# Altium schematic sheet MCU.SchDoc
size A3; SheetNumber: 1; SheetTotal: 2; SPICEModelCacheEDVCCXKY: <root> / <DocumentId>EDVCCXKY</DocumentId> / </root>
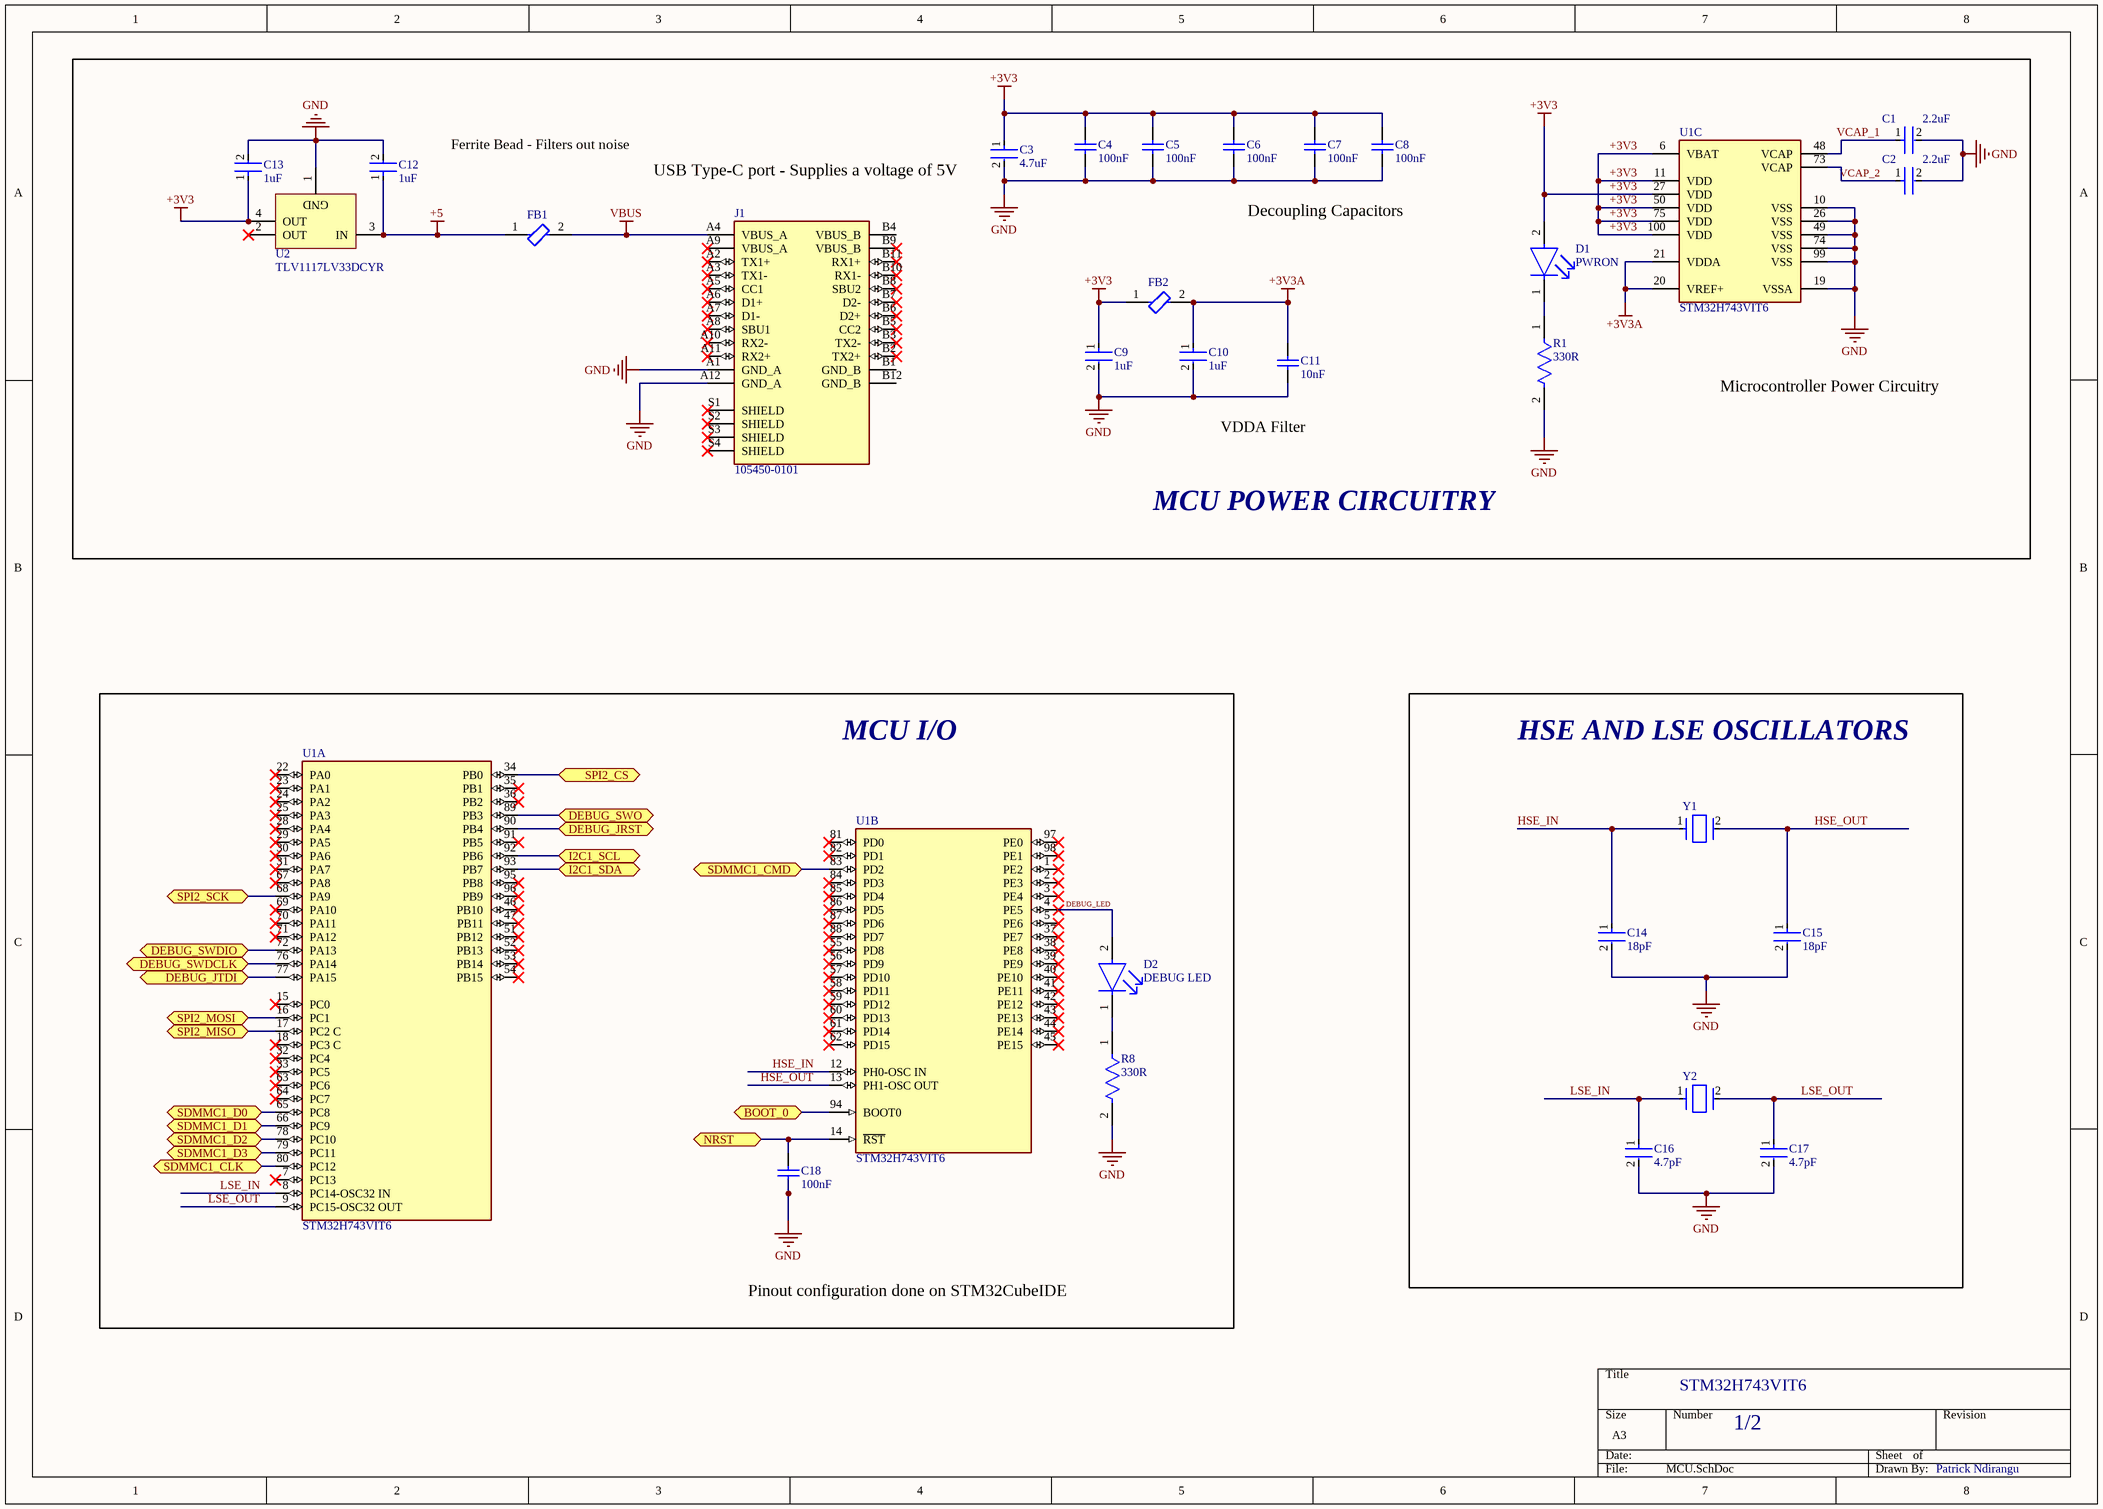
[diagram p0: MCU.SchDoc]

## Parts
C1  2.2uF  [FP-0805-L_2_01_0_2-W_1_25-IPC_C]
C2  2.2uF  [FP-0805-L_2_01_0_2-W_1_25-IPC_C]
C3  4.7uF  [FP-CL21-IPC_A]
C4  100nF  [CAPC1050X55X23ML05T13]
C5  100nF  [CAPC1050X55X23ML05T13]
C6  100nF  [CAPC1050X55X23ML05T13]
C7  100nF  [CAPC1050X55X23ML05T13]
C8  100nF  [CAPC1050X55X23ML05T13]
C9  1uF  [FP-CL10-IPC_C]
C10  1uF  [FP-CL10-IPC_C]
C11  10nF  [CAPC1608X90X35ML10T15]
C12  1uF  [FP-CL10-IPC_C]
C13  1uF  [FP-CL10-IPC_C]
C14  18pF  [FP-CL10-IPC_A]
C15  18pF  [FP-CL10-IPC_A]
C16  4.7pF  [FP-CL10-IPC_C]
C17  4.7pF  [FP-CL10-IPC_C]
C18  100nF  [CAPC1050X55X23ML05T13]
D1  PWRON  [FP-6_541-5092_01-4-MFG]
D2  DEBUG LED  [FP-6_541-5094_01-4-MFG]
FB1  MMZ1005D121CTD25  [FP-MMZ1005-IPC_C]  (value not drawn)
FB2  MMZ1005D121CTD25  [FP-MMZ1005-IPC_C]  (value not drawn)
J1  105450-0101  [MOLEX_105450-0101]
R1  330R  [FP-KTR03-MFG]
R8  330R  [FP-KTR03-MFG]
U1  STM32H743VIT6  [FP-LQFP100-1L-MFG]  (parts A,B,C of 3)
U2  TLV1117LV33DCYR  [DCY0004A_N]
Y1  ABM2-25.000MHZ-D4Y-T  [FP-ABM2-MFG]  (value not drawn)
Y2  ABS06-107-32.768KHZ-T  [FP-ABS06-MFG]  (value not drawn)

## Blocks framed on the sheet
MCU POWER CIRCUITRY: C1-C13 D1 FB1 FB2 J1 R1 U1 U2
MCU I/O: C18 D2 R8 U1
HSE AND LSE OSCILLATORS: C14-C17 Y1 Y2

## Ports
BOOT_0 (bidir, see OTHER PARTS[7C]), DEBUG_JRST (bidir, see OTHER PARTS[6C]), DEBUG_JTDI (bidir, see OTHER PARTS[6C]), DEBUG_SWDCLK (bidir, see OTHER PARTS[6C]), DEBUG_SWDIO (bidir, see OTHER PARTS[6C]), DEBUG_SWO (bidir, see OTHER PARTS[6C]), I2C1_SCL (bidir, see OTHER PARTS[2C]), I2C1_SDA (bidir, see OTHER PARTS[2C]), NRST (bidir, see OTHER PARTS[7D]), SDMMC1_CLK (bidir, see OTHER PARTS[3B]), SDMMC1_CMD (bidir, see OTHER PARTS[3B]), SDMMC1_D0 (bidir, see OTHER PARTS[3B]), SDMMC1_D1 (bidir, see OTHER PARTS[3B]), SDMMC1_D2 (bidir, see OTHER PARTS[3B]), SDMMC1_D3 (bidir, see OTHER PARTS[3B]), SPI2_CS (bidir, see OTHER PARTS[2C]), SPI2_MISO (bidir, see OTHER PARTS[2C]), SPI2_MOSI (bidir, see OTHER PARTS[2C]), SPI2_SCK (bidir, see OTHER PARTS[2C])

## Nets
+3V3: C3.1 C4.2 C5.2 C6.2 C7.2 C8.2 C9.1 C13.1 D1.2(A) FB2.1 U1.6(VBAT) U1.11(VDD) U1.27(VDD) U1.50(VDD) U1.75(VDD) U1.100(VDD) U2.4(OUT)
+3V3A: C10.1 C11.2 FB2.2 U1.20(VREF+) U1.21(VDDA)
+5: C12.1 FB1.1 U2.3(IN)
GND: C1.2 C2.2 C3.2 C4.1 C5.1 C6.1 C7.1 C8.1 C9.2 C10.2 C11.1 C12.2 C13.2 C14.2 C15.2 C16.2 C17.2 C18.1 J1.A1(GND_A) J1.A12(GND_A) R1.2 R8.2 U1.10(VSS) U1.19(VSSA) U1.26(VSS) U1.49(VSS) U1.74(VSS) U1.99(VSS) U2.1(GND)
VBUS: FB1.2 J1.A4(VBUS_A)
BOOT_0: U1.94(BOOT0) ; port BOOT_0
DEBUG_JRST: U1.90(PB4) ; port DEBUG_JRST
DEBUG_JTDI: U1.77(PA15) ; port DEBUG_JTDI
DEBUG_LED: D2.2(A) U1.4(PE5)
DEBUG_SWDCLK: U1.76(PA14) ; port DEBUG_SWDCLK
DEBUG_SWDIO: U1.72(PA13) ; port DEBUG_SWDIO
DEBUG_SWO: U1.89(PB3) ; port DEBUG_SWO
HSE_IN: C14.1 U1.12(PH0-OSC_IN) Y1.1
HSE_OUT: C15.1 U1.13(PH1-OSC_OUT) Y1.2
I2C1_SCL: U1.92(PB6) ; port I2C1_SCL
I2C1_SDA: U1.93(PB7) ; port I2C1_SDA
LSE_IN: C16.1 U1.8(PC14-OSC32_IN) Y2.1
LSE_OUT: C17.1 U1.9(PC15-OSC32_OUT) Y2.2
NRST: C18.2 U1.14(~{RST}) ; port NRST
SDMMC1_CLK: U1.80(PC12) ; port SDMMC1_CLK
SDMMC1_CMD: U1.83(PD2) ; port SDMMC1_CMD
SDMMC1_D0: U1.65(PC8) ; port SDMMC1_D0
SDMMC1_D1: U1.66(PC9) ; port SDMMC1_D1
SDMMC1_D2: U1.78(PC10) ; port SDMMC1_D2
SDMMC1_D3: U1.79(PC11) ; port SDMMC1_D3
SPI2_CS: U1.34(PB0) ; port SPI2_CS
SPI2_MISO: U1.17(PC2_C) ; port SPI2_MISO
SPI2_MOSI: U1.16(PC1) ; port SPI2_MOSI
SPI2_SCK: U1.68(PA9) ; port SPI2_SCK
VCAP_1: C1.1 U1.48(VCAP)
VCAP_2: C2.1 U1.73(VCAP)
NetD1_1: D1.1(C) R1.1
NetD2_1: D2.1(C) R8.1

Not connected (* = marked no-connect by the designer): J1 A2(TX1+)* A3(TX1-)* A5(CC1)* A6(D1+)* A7(D1-)* A8(SBU1)* A9(VBUS_A)* A10(RX2-)* A11(RX2+)* B1(GND_B) B2(TX2+)* B3(TX2-)* B4(VBUS_B) B5(CC2)* B6(D2+)* B7(D2-)* B8(SBU2)* B9(VBUS_B)* B10(RX1-)* B11(RX1+)* B12(GND_B) S1(SHIELD)* S2(SHIELD)* S3(SHIELD)* S4(SHIELD)*; U1 1(PE2)* 2(PE3)* 3(PE4)* 5(PE6)* 7(PC13)* 15(PC0)* 18(PC3_C)* 22(PA0)* 23(PA1)* 24(PA2)* 25(PA3)* 28(PA4)* 29(PA5)* 30(PA6)* 31(PA7)* 32(PC4)* 33(PC5)* 35(PB1)* 36(PB2)* 37(PE7)* 38(PE8)* 39(PE9)* 40(PE10)* 41(PE11)* 42(PE12)* 43(PE13)* 44(PE14)* 45(PE15)* 46(PB10)* 47(PB11)* 51(PB12)* 52(PB13)* 53(PB14)* 54(PB15)* 55(PD8)* 56(PD9)* 57(PD10)* 58(PD11)* 59(PD12)* 60(PD13)* 61(PD14)* 62(PD15)* 63(PC6)* 64(PC7)* 67(PA8)* 69(PA10)* 70(PA11)* 71(PA12)* 81(PD0)* 82(PD1)* 84(PD3)* 85(PD4)* 86(PD5)* 87(PD6)* 88(PD7)* 91(PB5)* 95(PB8)* 96(PB9)* 97(PE0)* 98(PE1)*; U2 2(OUT)*

## Notes on the sheet
- Ferrite Bead - Filters out noise
- (near C3) USB Type-C port - Supplies a voltage of 5V
- Decoupling Capacitors
- VDDA Filter
- Microcontroller Power Circuitry
- Pinout configuration done on STM32CubeIDE
- STM32H743VIT6
- 1/2
- Patrick Ndirangu

## Library data of the parts
C1 C2 = CMP-2007-04247-2: General Purpose Ceramic Capacitor, 0805, 2.2uF, 10%, X5R, 15%, 25V; Voltage Rating (DC): 25V; RoHS Compliant: Yes; Max Operating Temperature: 85°C; Case/Package: 0805; Capacitance: 2.2uF; Packaging: Tape and Reel; Termination: SMD/SMT; Tolerance: 10%; Contact Plating: Tin; Width: 1.25mm; Radiation Hardening: No; Thickness: 0.037inch; Construction: Flat; Lead Free: Lead Free; Case Code (Metric): 2012; Series: -; Height: 1.4mm; Length: 2.01mm; Package Quantity: 1; Min Operating Temperature: -55°C; Dielectric: X5R; Voltage Rating: 25V; Number of Pins: 2; Case Code (Imperial): 0805; Mount: Surface Mount; Depth: 1.25mm
C3 = CMP-13271-002624-1: CL21 Series 0805 4.7uF 25V ±10% Tolerance X5R Multilayer Ceramic Chip Capacitor; Case Code (Imperial): 0805; Thickness: 0.055inch; Mount: Surface Mount; Case Code (Metric): 2012; Capacitance: 4.7uF; Depth: 1.25mm; Lead Free: Lead Free; Case/Package: 0805; Voltage Rating: 25V; Package Quantity: 1; Width: 0.049inch; Radiation Hardening: No; Voltage Rating (DC): 25V; Length: 2mm; Dielectric: X5R; Height: 1.25mm; Packaging: Tape and Reel; Tolerance: 10%; Min Operating Temperature: -55°C; Max Operating Temperature: 85°C
C4-C8 C18 = CMP-2000-05439-1: Chip Capacitor, 100 nF, +/- 10%, 16 V, -55 to 125 degC, 0402 (1005 Metric), RoHS, Tape and Reel; Manufacturer: Samsung Electro-Mechanics; Capacitance: 100000pF; Dielectric: X7R; Rated Voltage: 16V; Case Size/Dimension: 0402; Tolerance (%): ±10%; Manufacturer URL: http://www.samsungsem.com/global/index.jsp; Datasheet URL: https://datasheet.ciiva.com/29198/458718-da-01-en-vs-kondensator-0402-29198423.pdf; Datasheet Version: Nov-10
C9 C10 C12 C13 = CMP-13271-004127-1: Cap Ceramic 1uF 25V X5R ±10% Pad SMD 0603 +85°C T/R; Height: 0.8mm; Capacitance: 1uF; Depth: 0.8mm; Package Quantity: 1; Mount: Surface Mount; Contact Plating: Tin; Voltage Rating: 25V; Dielectric: X5R; Packaging: Tape and Reel; Material: Ceramic; Case Code (Metric): 1608; Length: 1.6mm; Voltage: 25V; Min Operating Temperature: -55°C; Width: 0.031inch; Tolerance: 10%; Case/Package: 0603; Radiation Hardening: No; Case Code (Imperial): 0603; Thickness: 0.035inch; Lead Free: Lead Free; Max Operating Temperature: 85°C; Voltage Rating (DC): 25V
C11 = CMP-2100-03642-1: Chip Capacitor, 10 nF, +/- 10%, 50 V, -55 to 125 degC, 0603 (1608 Metric), RoHS, Tape and Reel; Manufacturer: Murata; Insulation Resistance: 10GR; Dielectric: X7R; Voltage Rating: 50V; Material: Ceramic; Package Quantity: 1; Lead Free: LeadFree; Case/Package: 0603; Termination: SMD/SMT; REACH SVHC: Unknown; Manufacturer URL: http://www.murata.com/; Datasheet URL: http://search.murata.co.jp/Ceramy/image/img/A01X/G101/ENG/GRM188R71H103KA01-01.pdf; Mount: SurfaceMount; Datasheet Version: 42401.0; Number of Pins: 2; Length: 1.6mm; Voltage: 50V; Depth: 0.8mm; Tolerance: 10%; Min Operating Temperature: -55degC; Voltage Rating (DC): 50V; Max Operating Temperature: 125degC; Package Description: 2-Pin Surface Mount Device, Body 1.6 x 0.8 mm; RoHSCompliant: True; Case Code (Imperial): 0603; Width: 0.031inch; Case Code (Metric): 1608; Height: 0.8mm; Package Reference: 0603; Packaging: TapeandReel; Thickness: 0.035inch; Capacitance: 10nF; Dielectric Material: Ceramic
C14 C15 = CMP-2000-06099-2: Cap Ceramic 18pF 50V C0G ±5% Pad SMD 0603 +125°C T/R; Temperature Coefficient: 300ppm/°C; Tolerance: 5%; Case/Package: 0603; Case Code (Metric): 1608; Depth: 0.8mm; Case Code (Imperial): 0603; Length: 1.6mm; Voltage Rating: 50V; Mount: Surface Mount; Thickness: 0.035inch; Radiation Hardening: No; Contact Plating: Tin; Voltage: 50V; Height: 0.8mm; Width: 0.031inch; Packaging: Tape and Reel; Max Operating Temperature: 125°C; Material: Ceramic; Min Operating Temperature: -55°C; Capacitance: 18pF; Dielectric: C0G
C16 C17 = CMP-13271-002893-1: Cap Ceramic 4.7pF 50V C0G ±0.25pF Pad SMD 0603 +125°C T/R; Temperature Coefficient: 300ppm/°C; Lead Free: Lead Free; Voltage Rating (DC): 50V; Width: 0.031inch; Package Quantity: 1; Voltage: 50V; Dielectric: C0G; Mount: Surface Mount; Case Code (Imperial): 0603; Max Operating Temperature: 125°C; Case Code (Metric): 1608; Length: 1.6mm; Material: Ceramic; Radiation Hardening: No; Min Operating Temperature: -55°C; Depth: 0.8mm; Thickness: 0.035inch; Height: 0.8mm; Voltage Rating: 50V; Capacitance: 4.7pF; Case/Package: 0603; Packaging: Tape and Reel
D1 = CMP-02520-000012-1: LED RED 0603 SMD; Manufacturer: Vishay; Manufacturer Part Number: VLMS1300-GS08; Forward Voltage: 2V; Reverse Voltage: 5V; Power Dissipation: 75mW; Forward Current: 20mA; Luminous Intensity: 54mcd; Led Orientation: Top View; Peak Emmision Wavelength: 639nm; Viewing Angle: 130°; Wavelength: 631nm; Digikey Description: LED RED 0603 SMD; Height: 1mm; Colour: Red; Ambient Temperature Range High: +85°C; Ambient Temperature Range Low: -35°C; Package: 6.541-5092.01-4; Automotive: No; Temperature Range High: +85°C; Device Class L3: unset; Lead Free: Yes; Temperature Range Low: -35°C; Temperature: -35°C to +85°C; Device Class L2: LEDs; ComponentLink2Description: Datasheet; Octopart: https://octopart.com/vlms1300-gs08-vishay-21709201; Device Class L1: Optoelectronics; RoHS: TRUE; ComponentLink2URL: http://www.vishay.com/docs/82437/vlmo1300.pdf; Mouser Description: Standard LEDs - SMD Super Red Clear Non-Diff; Category: Diode
D2 = CMP-02520-000013-1: LED BLUE 0603 SMD; Manufacturer Part Number: VLMB1300-GS08; Manufacturer: Vishay Semiconductor Opto Division; Forward Current: 20mA; Wavelength: 475nm; Viewing Angle: 130°; Forward Voltage: 3.8V; Power Dissipation: 76mW; Luminous Intensity: 28-180mcd; Led Orientation: Top View; Peak Emmision Wavelength: 468nm; RoHS: TRUE; ComponentLink2URL: http://www.vishay.com/docs/82437/vlmo1300.pdf; Ambient Temperature Range Low: -20°C; ComponentLink2Description: Datasheet; Mouser Description: LED; SMD; 0603; blue; 28-180mcd; 1.6x0.8x0.8mm; 130°; 2.8÷3.8V; 20mA; Package: 6.541-5094.01-4; Device Class L3: unset; Automotive: No; Temperature: -20°C to +80°C; Colour: Blue; Digikey Description: LED BLUE 0603 SMD; Device Class L2: LEDs; Temperature Range Low: -20°C; Lead Free: Yes; Category: Diode; Device Class L1: Optoelectronics; Height: 1mm; Octopart: https://octopart.com/vlmb1300-gs08-vishay-22022408; Temperature Range High: +80°C; Ambient Temperature Range High: +80°C
FB1 FB2 = CMP-08257-000320-1: Signal Line Ferrite Bead 120Ω @ 100MHz 350mA DCR 600mΩ AEC-Q200 SMD 0402; DC Resistance-Max: 600mR; Impedance: 120R; Number of Lines: 1; Max Current Rating: 350mA; Mount: Surface Mount; Case Code (Imperial): 0402; Case Code (Metric): 1005; Lead Free: Lead Free; Series: MMZ; Min Operating Temperature: -55°C; DC Resistance (DCR): 600mR; Height: 0.022inch; Case/Package: 0402; Current Rating: 350mA; Ratings: AEC-Q200; Packaging: Tape and Reel; Max Operating Temperature: 125°C; RoHS Compliant: Yes; Length: 0.039inch; Width: 0.02inch; Package Quantity: 10000
J1 = 105450-0101: USB-C (USB TYPE-C) USB 3.2 Gen 2 (USB 3.1 Gen 2, Superspeed + (USB 3.1)) Receptacle Connector 24 Position Surface Mount, Right Angle; Through Hole; MF: Molex; MP: 1054500101; Value: *; SnapEDA_Link: https://www.snapeda.com/parts/1054500101/Molex/view-part/?ref=snap; Purchase-URL: https://pricing.snapeda.com/search/part/1054500101/?ref=eda; Check_prices: https://www.snapeda.com/parts/1054500101/Molex/view-part/?ref=eda; Digi-Key_Part_Number: WM12856TR-ND; Package: None; Supplier 1: Digi-Key; Supplier Part Number 1: WM12856CT-ND; Supplier 2: LCSC; Supplier Part Number 2: C919444
R1 R8 = CMP-08839-007468-1: Res Thick Film 0603 330Ω 1% 0.1W ±100ppm/°C Automotive Paper T/R; Max Power Dissipation: 100mW; Features: Automotive AEC-Q200; Length: 0.063inch; RoHS Compliant: Yes; Temperature Coefficient: 100ppm/°C; Number of Terminations: 2; Tolerance: 1%; Min Operating Temperature: -55°C; Package Quantity: 5000; Case/Package: 0603; Case Code (Metric): 1608; Width: 0.031inch; Resistance: 330R; Series: KTR; Resistor Type: Thick Film; Packaging: Cut Tape; Case Code (Imperial): 0603; Max Operating Temperature: 155°C; Height: 0.022inch
U1 = CMP-12105-000050-1: IC MCU 32BIT 2MB FLASH 100LQFP; Manufacturer: STMicroelectronics; Number Of Ethernet Channels: 1; Number Of Usb Channels: 2; Number Of A/D Converters: 3; Min Supply Voltage: 1.71V; Ram Size: 1060KBytes; Number Of I2C Channels: 4; Frequency: 480MHz; Number Of Adc Channels: 36; Number Of I/Os: 82; Max Supply Voltage: 3.6V; Number Of Spi Channels: 6; Memory Size: 2MBytes; Max Junction Temp: +125°C; Core Architecture: Arm Cortex-M7; Interface: I2C,SPI,UART,USART,USB,LIN,IrDA,Ethernet,I2S,Other; Number Of Timers/Counters: 20; Data Bus Width: 32bits; Number Of Pwm Channels: 42; Number Of Uart Channels: 9; Standoff Height: 0.05mm; Device Class L1: Integrated Circuits (ICs); ComponentLink2URL: https://www.st.com/resource/en/datasheet/stm32h743vi.pdf; Automotive: No; Memory Type: FLASH; Number Of Cores: 1; Temperature Range Low: -40°C; RoHS: TRUE; Ambient Temperature Range Low: -40°C; ComponentLink2Description: Datasheet; Device Class L2: Embedded Processors and Controllers; Device Class L3: Microcontrollers; Digikey Description: IC MCU 32BIT 2MB FLASH 100LQFP; Temperature Range High: +125°C; Ambient Temperature Range High: +85°C; Package: LQFP100-1L; Temperature: -40°C to +125°C; Category: IC; Ipc Land Pattern Name: QFP50P1600X1600X160-100; Height: 1.6mm; Manufacturer Part Number: STM32H743VIT6; Octopart: https://octopart.com/stm32h743vit6-stmicroelectronics-76372527; Lead Free: Yes
U2 = CMP-0395-00503-2: Single Output LDO, 1 A, Fixed 3.3 V Output, 2 to 5.5 V Input, 4-pin SOT-223 (DCY), -40 to 125 degC, Green (RoHS & no Sb/Br); Manufacturer: Texas Instruments; Vout Adj(Min)(V): 3.3; Vdo(Typ)(mV): 1200; Iq(Typ)(mA): 0.05; Accuracy(%): 2; Iout(Max)(A): 1; SubFamily: Single Channel LDO; Vin(Max)(V): 5.5; PackageReference: DCY0004A; PackageDescription: 4-Pin Plastic Small Outline, Body 3.5 x 6.5 mm, Pitch 2.3 mm; Vout Adj(Max)(V): 3.3; Mounting Technology: Surface Mount; ComponentLink2Description: Datasheet; ComponentLink1Description: Manufacturer URL; PartNumber: TLV1117LV33DCYR; ComponentLink3Description: Package Specification; ComponentLink1URL: http://www.ti.com/; ComponentLink2URL: http://www.ti.com/general/docs/lit/getliterature.tsp?genericPartNumber=TLV1117LV33&fileType=pdf; Fixed Output Options(V): 3.3; PackageVersion: 4202506/B; Vin(Min)(V): 2; DatasheetVersion: SBVS160A; Eco-Plan: Green (RoHS & no Sb/Br); ComponentLink3URL: http://www.ti.com/litv/pdf/mpds094a; Code_JEDEC: TO-261
Y1 = CMP-27762-013592-1: Crystal 25MHz ±30ppm 18pF SMD-2 8mm x 4.5mm; Series Resistance: 50R; Height: 0.063inch; RoHS Compliant: Yes; Tolerance: 30ppm; Frequency Tolerance: 30ppm; Frequency Stability: 30ppm; Mount: Surface Mount; Depth: 4.5mm; Number of Pins: 2; Frequency: 25MHz; Min Operating Temperature: -40°C; Case/Package: CSMD; Width: 0.177inch; Length: 8mm; Resistor Type: Ceramic; ESR (Equivalent Series Resistance): 50R; Termination: SMD/SMT; Package Quantity: 1000; Series: ABM2; Packaging: Tape and Reel; Load Capacitance: 18pF; Max Operating Temperature: 85°C
Y2 = CMP-2000-05734-3: Crystal 32.768kHz ±20ppm (Tol) 4pF FUND 60kΩ 2-Pin Mini-CSMD T/R; Frequency Stability: 175ppm; ESR (Equivalent Series Resistance): 60kR; Series Resistance: 80kR; Radiation Hardening: No; Case Code (Metric): 2012; Frequency: 32.768kHz; Lead Free: Lead Free; Series: ABS06; Package Quantity: 3000; Number of Pins: 2; Length: 2mm; Max Operating Temperature: 85°C; Case/Package: SMD/SMT; Packaging: Tape and Reel; Mount: Surface Mount; Min Operating Temperature: -40°C; Frequency Tolerance: 20ppm; Tolerance: 20ppm; Case Code (Imperial): 0805; Width: 1.2mm; Termination: SMD/SMT; RoHS Compliant: Yes; Load Capacitance: 4pF; Height: 0.6mm